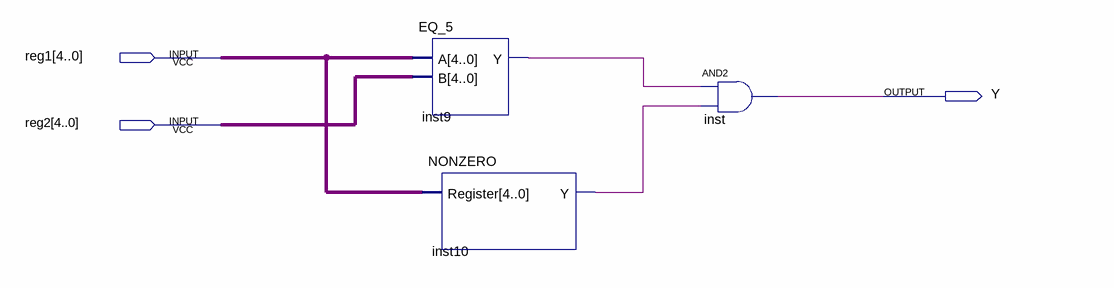
[diagram p0: schematic sheet]
// Quartus schematic REGCheck.bdf as structural Verilog: 3 symbols, 3 pins
module REGCheck (
  input  [4:0] reg1,
  input  [4:0] reg2,
  output Y
);

  wire inst9_y, inst10_y;

  EQ_5 inst9 (.A(reg1), .B(reg2), .Y(inst9_y));
  NONZERO inst10 (.Register(reg1), .Y(inst10_y));
  and inst (Y, inst9_y, inst10_y);
endmodule
